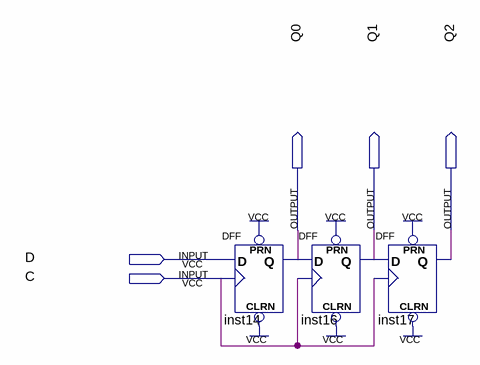
[diagram p0: schematic sheet]
// Quartus schematic RG.bdf as structural Verilog: 3 symbols, 5 pins
module RG (
  input  D,
  input  C,
  output Q0,
  output Q1,
  output Q2
);

  DFF inst14 (.CLRN(1'b1), .CLK(C), .D(D), .PRN(1'b1), .Q(Q0));
  DFF inst16 (.CLRN(1'b1), .CLK(C), .D(Q0), .PRN(1'b1), .Q(Q1));
  DFF inst17 (.CLRN(1'b1), .CLK(C), .D(Q1), .PRN(1'b1), .Q(Q2));
endmodule
